# Altium schematic sheet Gator Stream Transmitter Sheet.SchDoc
size Letter
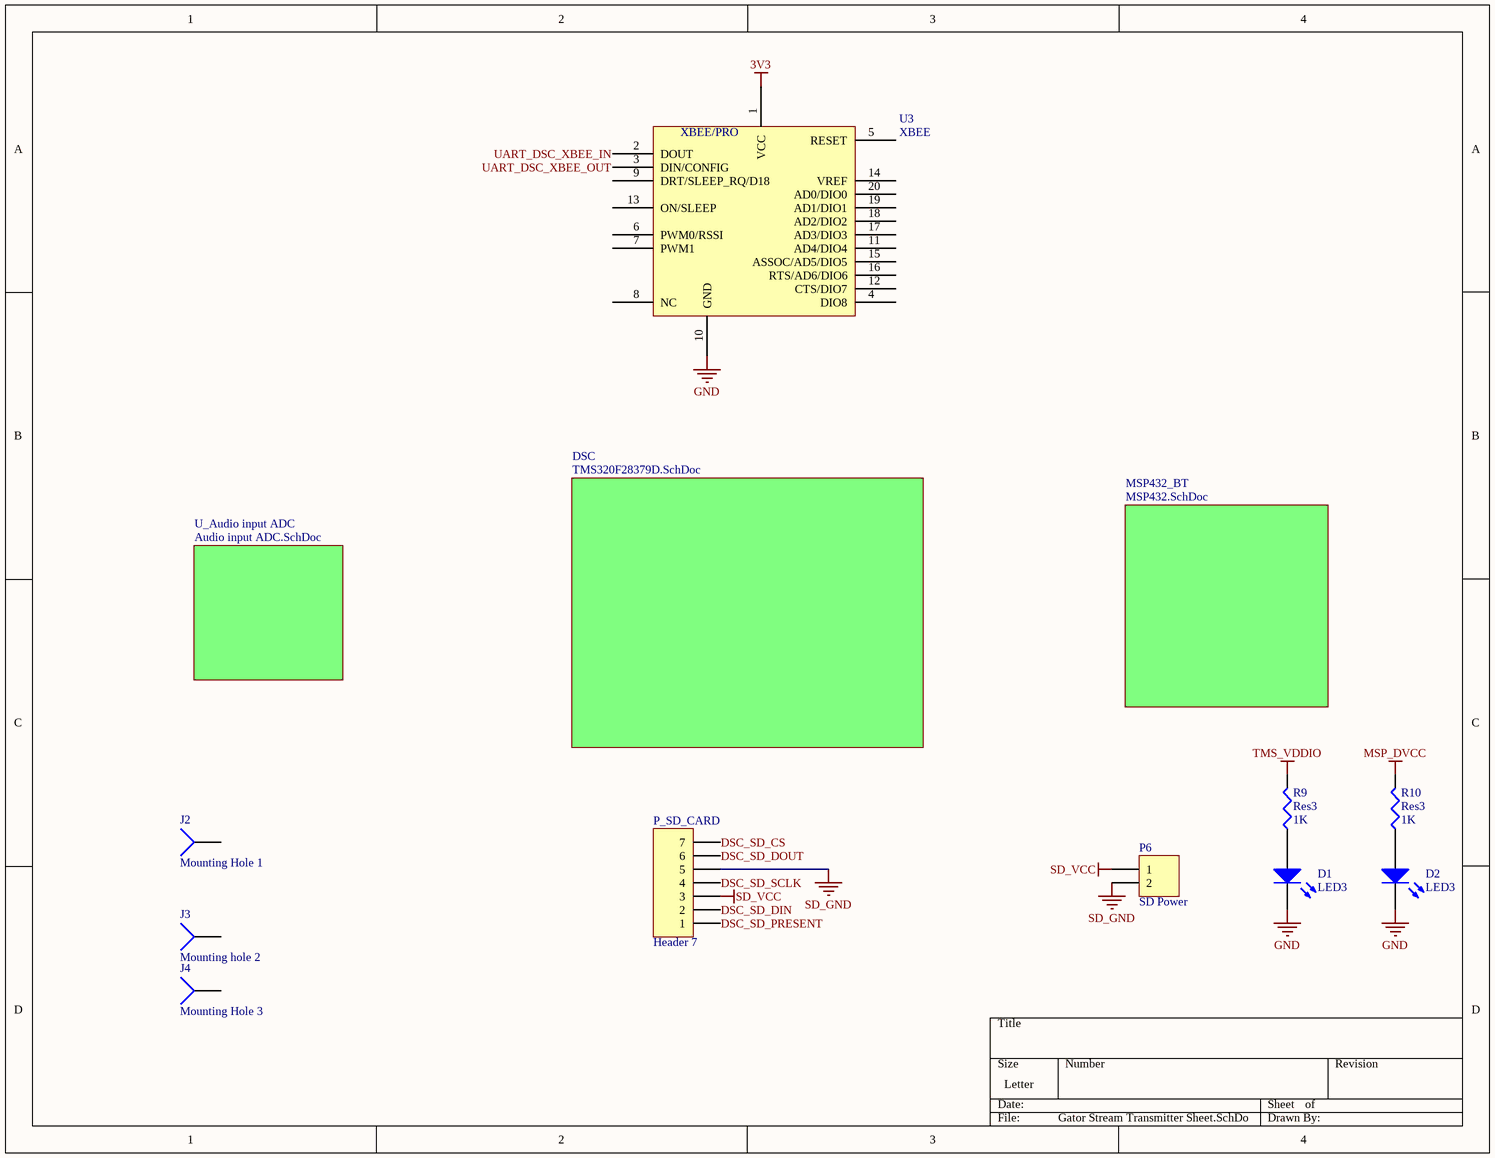
[diagram p0: Gator Stream Transmitter Sheet.SchDoc]

## Parts
D1  LED3  [3.5X2.8X1.9]
D2  LED3  [3.5X2.8X1.9]
J2  Mounting Hole 1  [PIN1]
J3  Mounting hole 2  [PIN1]
J4  Mounting Hole 3  [PIN1]
P6  SD Power  [HDR1X2]
P_SD_CARD  Header 7  [HDR1X7]
R9  Res3  value 1K  [14-1210]
R10  Res3  value 1K  [14-1210]
U3  XBEE  [XBEE/PRO]

## Sub-sheets
DSC = TMS320F28379D.SchDoc: no entries
MSP432_BT = MSP432.SchDoc: no entries
U_Audio input ADC = Audio input ADC.SchDoc: no entries

## Nets
3V3: U3.1(VCC)
GND: D1.2(K) D2.2(K) U3.10(GND)
MSP_DVCC: R10.2
SD_GND: P6.2 P_SD_CARD.5
SD_VCC: P6.1 P_SD_CARD.3
TMS_VDDIO: R9.2
DSC_SD_CS: P_SD_CARD.7
DSC_SD_DIN: P_SD_CARD.2
DSC_SD_DOUT: P_SD_CARD.6
DSC_SD_PRESENT: P_SD_CARD.1
DSC_SD_SCLK: P_SD_CARD.4
UART_DSC_XBEE_IN: U3.2(DOUT)
UART_DSC_XBEE_OUT: U3.3(DIN/CONFIG)
NetD1_1: D1.1(A) R9.1
NetD2_1: D2.1(A) R10.1

Not connected (* = marked no-connect by the designer): J2 1; J3 1; J4 1; U3 4(DIO8) 5(RESET) 6(PWM0/RSSI) 7(PWM1) 8(NC) 9(DRT/SLEEP_RQ/D18) 11(AD4/DIO4) 12(CTS/DIO7) 13(ON/SLEEP) 14(VREF) 15(ASSOC/AD5/DIO5) 16(RTS/AD6/DIO6) 17(AD3/DIO3) 18(AD2/DIO2) 19(AD1/DIO1) 20(AD0/DIO0)

## Notes on the sheet
- (in symbol XBEE) XBEE/PRO

## Library data of the parts
D1 D2 = LED3: Typical BLUE SiC LED; Published: 8-Jun-2000; LatestRevisionDate: 17-Dec-2003; LatestRevisionNote: PCB Footprint replaced.; DatasheetVersion: 16-Apr-2002; PackageVersion: 16-Apr-2002; PackageReference: 3.5X2.8X1.9; Publisher: Altium Limited; PackageDescription: SM LED; 2 C-Bend Leads; Body 3.5 x 2.8 x 1.9 mm, inc leads (LxWxH typ)
J2-J4 = Socket: LatestRevisionDate: 17-Jul-2002; LatestRevisionNote: Re-released for DXP Platform.; Publisher: Altium Limited
P6 = Header 2: Header, 2-Pin; LatestRevisionDate: 17-Jul-2002; LatestRevisionNote: Re-released for DXP Platform.; Publisher: Altium Limited
P_SD_CARD = Header 7: Header, 7-Pin; LatestRevisionDate: 17-Jul-2002; LatestRevisionNote: Re-released for DXP Platform.; Publisher: Altium Limited
R9 R10 = Res3: Resistor; Published: 8-Jun-2000; LatestRevisionDate: 29-May-2009; LatestRevisionNote: IPC-7351 Footprint Added.; PackageReference: J1-0603; Publisher: Altium Limited; PackageDescription: Chip Resistor